# Altium schematic sheet Connections.SchDoc
size A; SheetNumber: 2; SheetTotal: 2
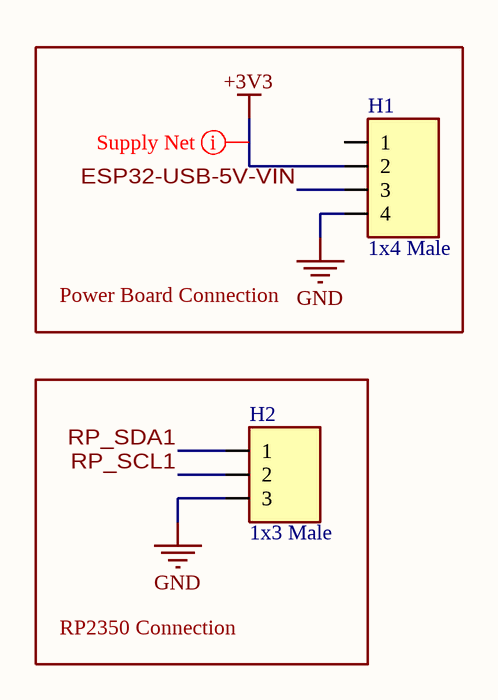
[diagram p0: Connections.SchDoc]

## Parts
H1  1x4 Male  [[Header] Shrouded 1x4 Male]
H2  1x3 Male  [[Header] Shrouded 1x3 Male]

## Blocks framed on the sheet
Power Board Connection: H1
RP2350 Connection: H2

## Nets
+3V3: H1.2
GND: H1.4 H2.3
ESP32-USB-5V-VIN: H1.3
RP_SCL1: H2.2
RP_SDA1: H2.1

Not connected (* = marked no-connect by the designer): H1 1

## Layout directives
net class Supply_Nets: +3V3

## Library data of the parts
H1 = [Header] Shrouded 1x4 Male: 70543-0003 / Mates with 005057-9404; Supplier 1: Avnet; Supplier Part Number 1: 0705430003
H2 = [Header] Shrouded 1x3 Male: 070543-0037 / Mates with 005057-9403; Supplier 1: DigiKey; Supplier 2: DigiKey; Supplier Part Number 1: WM4825-ND; Supplier Part Number 2: WM2901-ND